# Altium project IOTLoRaSmartGreenhouseGateway.PrjPCB
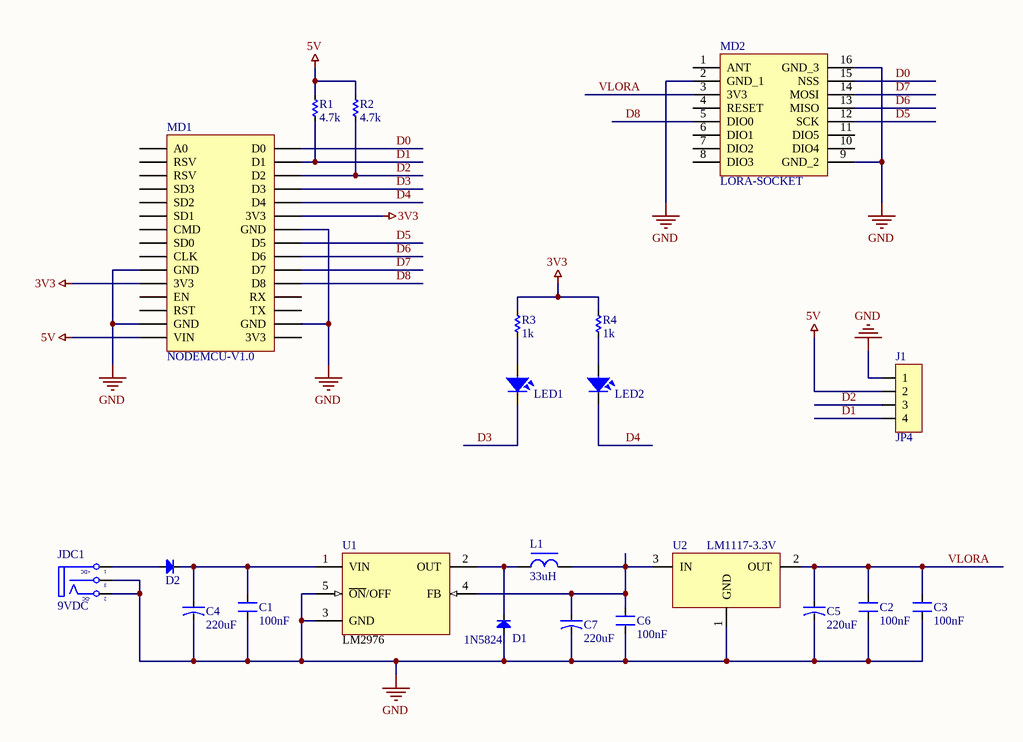
[diagram p0: IOTLoRaSmartGreenhouseGateway.SchDoc]
1 sheet, 22 parts. Net scope: global (net labels, ports and power ports of the same name join across sheets).
Board file: IOTLoRaSmartGreenhouseGateway.PcbDoc

## Sheet IOTLoRaSmartGreenhouseGateway.SchDoc
size A

### Parts
C1  100nF  [CN1.5]
C2  100nF  [CN1.5]
C3  100nF  [CN1.5]
C4  220uF  [CA-ALU-8]
C5  220uF  [CA-ALU-8]
C6  100nF  [CN1.5]
C7  220uF  [CA-ALU-8]
D1  1N5824  [DIO-5A]
D2  Diode  [DIO-3A]  (value not drawn)
J1  JP4  [JP4-D1C]
JDC1  9VDC  [DC0]
L1  33uH  [L-DIP-M-10]
LED1  LED  [LED-3MM-BLUE]  (value not drawn)
LED2  LED  [LED-3MM-BLUE]  (value not drawn)
MD1  NODEMCU-V1.0  [NODEMCU-V1.0]
MD2  LORA-SOCKET  [LORA-SOCKET]
R1  4.7k  [RES-1/4W]
R2  4.7k  [RES-1/4W]
R3  1k  [RES-1/4W]
R4  1k  [RES-1/4W]
U1  LM2976  [TO263]
U2  LM1117-3.3V  [SOT223]

### Nets
3V3: MD1.3V3 R3.1 R4.1
5V: J1.2 MD1.VIN R1.1 R2.1
GND: C1.2 C2.2 C3.2 C4.2 C5.2 C6.2 C7.2 D1.1(A) J1.1 JDC1.2(TN) JDC1.3(S) MD1.GND MD2.2(GND_1) MD2.9(GND_2) MD2.16(GND_3) U1.3(GND) U1.5(~{ON}/OFF) U2.1(GND)
D0: MD1.D0 MD2.15(NSS)
D1: J1.4 MD1.D1 R1.2
D2: J1.3 MD1.D2 R2.2
D3: LED1.2 MD1.D3
D4: LED2.2 MD1.D4
D5: MD1.D5 MD2.12(SCK)
D6: MD1.D6 MD2.13(MISO)
D7: MD1.D7 MD2.14(MOSI)
D8: MD1.D8 MD2.5(DIO0)
VLORA: C2.1 C3.1 C5.1 MD2.3(3V3) U2.2(OUT)
NetC1_1: C1.1 C4.1 D2.2(K) U1.1(VIN)
NetC6_1: C6.1 C7.1 L1.2 U1.4(FB) U2.3(IN)
NetD1_2: D1.2(K) L1.1 U1.2(OUT)
NetD2_1: D2.1(A) JDC1.1(T)
NetLED1_1: LED1.1 R3.2
NetLED2_1: LED2.1 R4.2

Not connected (* = marked no-connect by the designer): MD1 A0 CLK CMD EN RST RSV RX SD0 SD1 SD2 SD3 TX; MD2 1(ANT) 4(RESET) 6(DIO1) 7(DIO2) 8(DIO3) 10(DIO4) 11(DIO5)

### Notes on the sheet
- (in symbol DCIN) +DC; -DC

### Library data of the parts
C1-C3 C6 = CN: Value: 33pF
C4 C5 C7 = CN-ALU-DIP: Capacitor (Semiconductor SIM Model); Value: 104; LatestRevisionDate: 17-Jul-2002; LatestRevisionNote: Re-released for DXP Platform.; PackageReference: C1206; Publisher: Altium Limited
D1 D2 = Diode: Default Diode; Code - JEDEC: DO-214-AB; Value: 1N5007; Published: 8-Jun-2000; Revision: July-2002: Re-released for DXP Platform.; Publisher: Altium Limited
J1 = JP4: WR-PHD 2.54 mm Angled Socket Header; Manufacturer: W¨¹rth Elektronik eiSos GmbH; partNo: 613004143121; ComponentLink1 Description: Manufacturer; ComponentLink2 Description: Datasheet; NoPins: 04; Created Date: 29 March 2013; ComponentLink1URL: http://www.we-online.com; ComponentLink2URL: http://katalog.we-online.de/em/datasheet/6130xx143121.pdf; Created by: Karrer Zheng
JDC1 = DCIN: Jac DC input; Value: Jac DC
L1 = L-DIP-1: Inductor; Value: 150 mH
LED1 LED2 = LED: LED Single colour Green and Red; Value: LED 3 ly Single Colour
MD1 = NODEMCU-V1.0: KIT NodeMCU v1.0
MD2 = LORA-SOCKET: Socket LoRa RA01 va RA02
R1-R4 = Res: Manufacturer: Generic Components; Class: Passive; SubClass: R; Published: 08/06/2000; Publisher: Altium Hobart Technology Centre
U1 = LM2596: Max Input Voltage: 12 V; Max Output Current: 3 (6.0 peak) A; Max Output Voltage: mV; Category: IC-Power; Min Input Voltage: mV; Min Output Voltage: mV; Mounting Technology: Surface Mount; Status: Unreleased; Supply Voltage: mV; Temperature Range: -40 to +125 degC
U2 = LM1117: 800mA Low-Dropout Linear Regulator; Creator: Nguyen Ba Bien; Website: http://group3i.net